# Altium schematic sheet Nucleo.SchDoc: Nucleo kártya
size A4; Author: Debreczeni László; Organization: BME-AUT; DocumentNumber: 1; Revision: A27; SheetNumber: 1; SheetTotal: 5
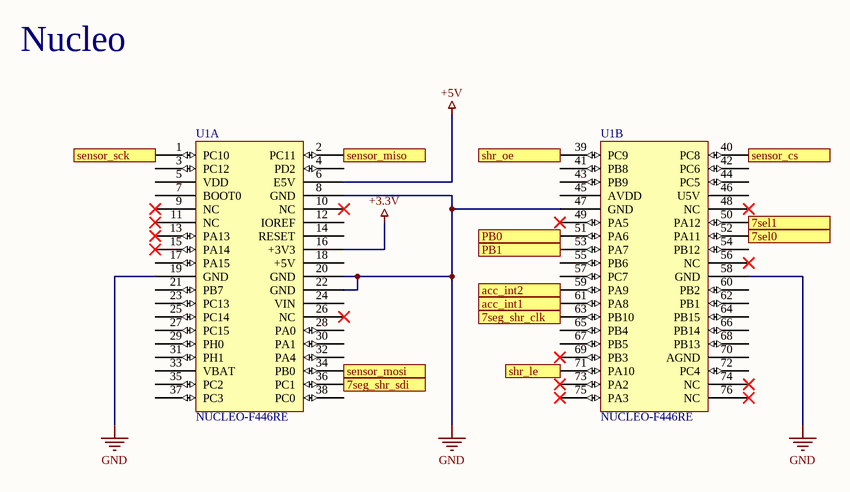
[diagram p0: Nucleo.SchDoc]

## Parts
U1  NUCLEO-F446RE  [FP_NUCLEO-64]  (parts A,B of 2)

## Ports
7seg_shr_clk (out), 7seg_shr_sdi (out), 7sel0 (out), 7sel1 (out), acc_int1 (in), acc_int2 (in), PB0 (in), PB1 (in), sensor_cs (out), sensor_miso (in), sensor_mosi (out), sensor_sck (out), shr_le (out), shr_oe (out)

## Nets
+3.3V: U1.16(+3V3)
+5V: U1.6(E5V)
GND: U1.8(GND) U1.19(GND) U1.20(GND) U1.22(GND) U1.47(GND) U1.58(GND)
7seg_shr_clk: U1.63(PB10) ; port 7seg_shr_clk
7seg_shr_sdi: U1.36(PC1) ; port 7seg_shr_sdi
7sel0: U1.52(PA11) ; port 7sel0
7sel1: U1.50(PA12) ; port 7sel1
acc_int1: U1.61(PA8) ; port acc_int1
acc_int2: U1.59(PA9) ; port acc_int2
PB0: U1.51(PA6) ; port PB0
PB1: U1.53(PA7) ; port PB1
sensor_cs: U1.40(PC8) ; port sensor_cs
sensor_miso: U1.2(PC11) ; port sensor_miso
sensor_mosi: U1.34(PB0) ; port sensor_mosi
sensor_sck: U1.1(PC10) ; port sensor_sck
shr_le: U1.71(PA10) ; port shr_le
shr_oe: U1.39(PC9) ; port shr_oe

Not connected (* = marked no-connect by the designer): U1 3(PC12) 4(PD2) 5(VDD) 7(BOOT0) 9(NC)* 10(NC)* 11(NC)* 12(IOREF) 13(PA13)* 14(RESET) 15(PA14)* 17(PA15) 18(+5V) 21(PB7) 23(PC13) 24(VIN) 25(PC14) 26(NC)* 27(PC15) 28(PA0) 29(PH0) 30(PA1) 31(PH1) 32(PA4) 33(VBAT) 35(PC2) 37(PC3) 38(PC0) 41(PB8) 42(PC6) 43(PB9) 44(PC5) 45(AVDD) 46(U5V) 48(NC)* 49(PA5)* 54(PB12) 55(PB6) 56(NC)* 57(PC7) 60(PB2) 62(PB1) 64(PB15) 65(PB4) 66(PB14) 67(PB5) 68(PB13) 69(PB3)* 70(AGND) 72(PC4) 73(PA2)* 74(NC)* 75(PA3)* 76(NC)*

## Notes on the sheet
- Nucleo
- Title
- Size:
- Date:
- A4
- Number:
- Time:
- Revision:
- Sheet
- of
- File:

## Library data of the parts
U1 = NUCLEO-F446RE: Reference: NUCLEO; Name: Nucleo F446RE; Supplier: Tanszék